# Altium schematic sheet BAT_18650X2.SchDoc
size A4; PageSetup: Record=PageOptions|CenterHorizontal=True|CenterVertical=True|PrintScale=1.00|XCorrection=1.00|YCorrection=1.00|PrintKind=1|BorderSize=5000000|LeftOffset=0|BottomOffset=0|Orientation=2|PaperLength=2970|PaperWidth=2100|Scale=100|PaperSource=7|PrintQuality=-4|MediaType=1|DitherType=10|PaperKind=A4 210 x 297 ºÁÃ×|PrintScaleMode=1
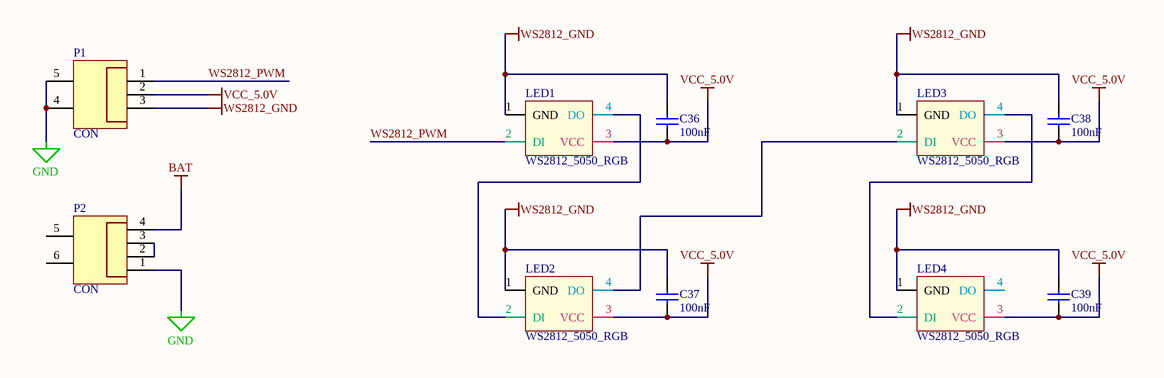
[diagram p0: BAT_18650X2.SchDoc]

## Parts
C36  100nF  [0402_C]
C37  100nF  [0402_C]
C38  100nF  [0402_C]
C39  100nF  [0402_C]
LED1  WS2812_5050_RGB  [RGB_50X50]
LED2  WS2812_5050_RGB  [RGB_50X50]
LED3  WS2812_5050_RGB  [RGB_50X50]
LED4  WS2812_5050_RGB  [RGB_50X50]
P1  CON  [BM03B-GHS-TBT(TOP)]
P2  CON  [18650X2]

## Nets
BAT: P2.4
GND: P1.4 P1.5 P2.1
VCC_5.0V: C36.2 C37.2 C38.2 C39.2 LED1.3(VCC) LED2.3(VCC) LED3.3(VCC) LED4.3(VCC) P1.2
WS2812_GND: C36.1 C37.1 C38.1 C39.1 LED1.1(GND) LED2.1(GND) LED3.1(GND) LED4.1(GND) P1.3
WS2812_PWM: LED1.2(DI) P1.1
NetLED1_4: LED1.4(DO) LED2.2(DI)
NetLED2_4: LED2.4(DO) LED3.2(DI)
NetLED3_4: LED3.4(DO) LED4.2(DI)
NetP2_2: P2.2 P2.3

Not connected (* = marked no-connect by the designer): LED4 4(DO); P2 5 6

## Library data of the parts
C36-C39 = Cap: Capacitor; Published: 8-Jun-2000; LatestRevisionDate: 17-Jul-2002; LatestRevisionNote: Re-released for DXP Platform.; PackageReference: RAD-0.3; Publisher: Altium Limited; Value: 100nF
P1 = CON-3
P2 = CON-4